# Altium schematic sheet Compressor.SchDoc
size B
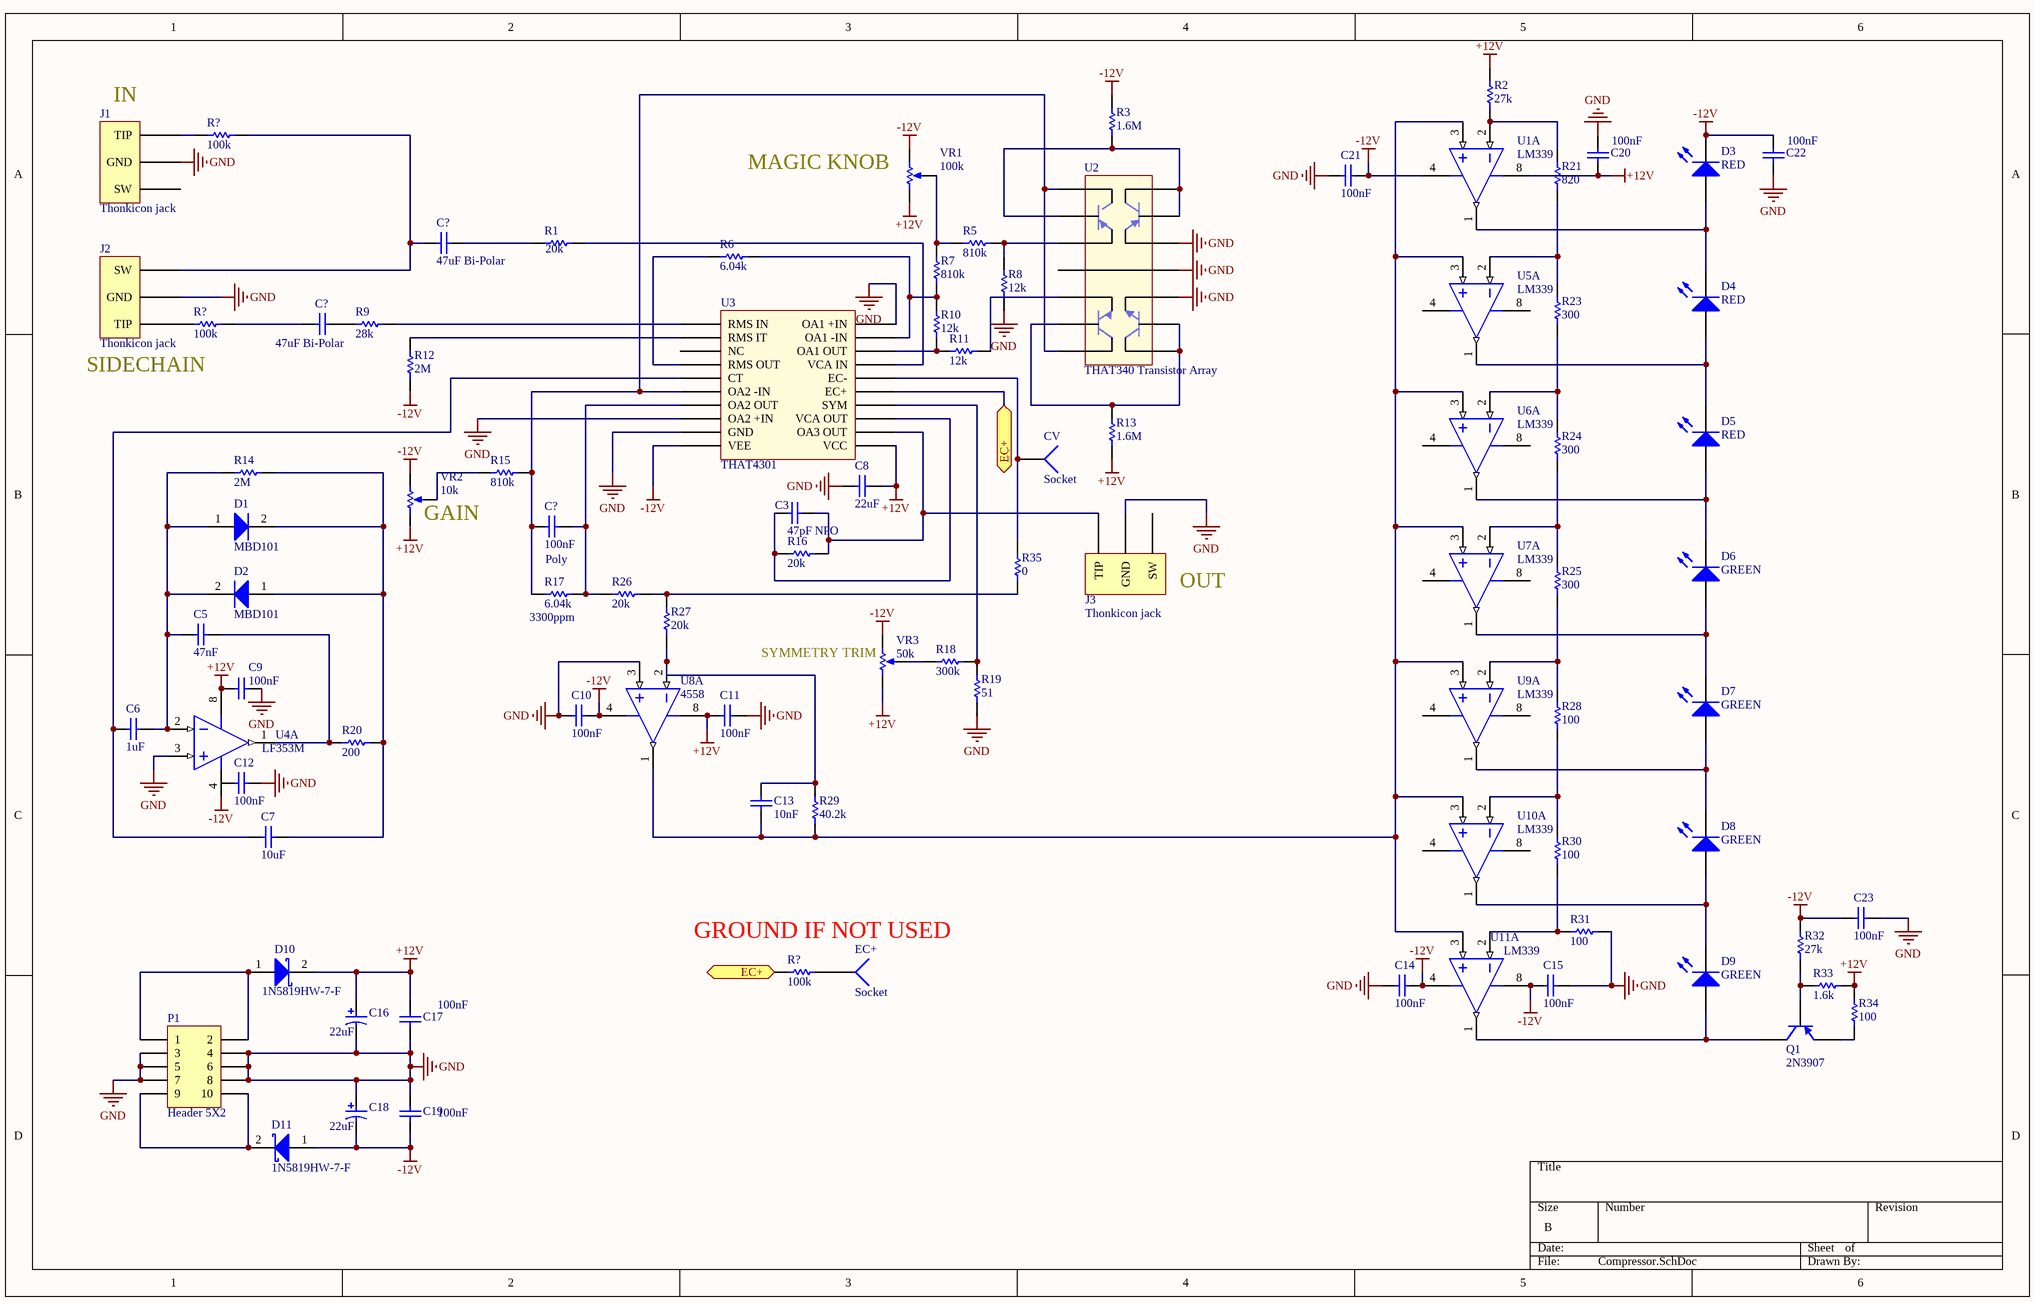
[diagram p0: Compressor.SchDoc]

## Parts
(Parts that share a designator on the sheet are numbered #1, #2 ... from top to bottom, then left to right.)
C3  47pF NPO  [CAPC1206(3216)190_N]
C5  47nF  [CAPC1206(3216)190_N]
C6  1uF  [CAPC1206(3216)190_N]
C7  10uF  [CAPC1206(3216)190_N]
C8  22uF  [CAPC1206(3216)190_N]
C9  100nF  [CAPC0603(1608)100_M]
C10  100nF  [CAPC0603(1608)100_M]
C11  100nF  [CAPC0603(1608)100_M]
C12  100nF  [CAPC0603(1608)100_M]
C13  10nF  [CAPC1206(3216)190_N]
C14  100nF  [CAPC0603(1608)100_M]
C15  100nF  [CAPC0603(1608)100_M]
C16  22uF  [NIC-CAPA2-4X5.8_V]
C17  100nF  [CAPC0603(1608)100_M]
C18  22uF  [NIC-CAPA2-4X5.8_V]
C19  100nF  [CAPC0603(1608)100_M]
C20  100nF  [CAPC0603(1608)100_M]
C21  100nF  [CAPC0603(1608)100_M]
C22  100nF  [CAPC0603(1608)100_M]
C23  100nF  [CAPC0603(1608)100_M]
C?#1  47uF Bi-Polar  [Nichicon Bi-Polar 6.3mm]
C?#2  47uF Bi-Polar  [Nichicon Bi-Polar 6.3mm]
C?#3  100nF  Type: Poly  [WIMA Poly Cap]
CV  Socket  [PIN1]
D1  MBD101  [ONSC-TO-92-2-182-06]
D2  MBD101  [ONSC-TO-92-2-182-06]
D3  RED  [LED-0]
D4  RED  [LED-0]
D5  RED  [LED-0]
D6  GREEN  [LED-0]
D7  GREEN  [LED-0]
D8  GREEN  [LED-0]
D9  GREEN  [LED-0]
D10  1N5819HW-7-F  [DIOD-SOD-123-2_V]
D11  1N5819HW-7-F  [DIOD-SOD-123-2_V]
EC+  Socket  [PIN1]
J1  Thonkicon jack  [Thonkiconn Pot PJ301M]
J2  Thonkicon jack  [Thonkiconn Pot PJ301M]
J3  Thonkicon jack  [Thonkiconn Pot PJ301M]
P1  Header 5X2  [HDR2X5]
Q1  2N3907  [TO-92A]
R1  20k  [RESC0603(1608)_M]
R2  27k  [RESC0603(1608)_M]
R3  1.6M  [RESC0603(1608)_M]
R5  810k  [RESC0603(1608)_M]
R6  6.04k  [RESC0603(1608)_M]
R7  810k  [RESC0603(1608)_M]
R8  12k  [RESC0603(1608)_M]
R9  28k  [RESC0603(1608)_M]
R10  12k  [RESC0603(1608)_M]
R11  12k  [RESC0603(1608)_M]
R12  2M  [RESC0603(1608)_M]
R13  1.6M  [RESC0603(1608)_M]
R14  2M  [RESC0603(1608)_M]
R15  810k  [RESC0603(1608)_M]
R16  20k  [RESC0603(1608)_M]
R17  Temp Cpef: 3300ppm  [RESC0603(1608)_M]  (hidden comment: 6.04k)
R18  300k  [RESC0603(1608)_M]
R19  51  [RESC0603(1608)_M]
R20  200  [RESC0603(1608)_M]
R21  820  [RESC0603(1608)_M]
R23  300  [RESC0603(1608)_M]
R24  300  [RESC0603(1608)_M]
R25  300  [RESC0603(1608)_M]
R26  20k  [RESC0603(1608)_M]
R27  20k  [RESC0603(1608)_M]
R28  100  [RESC0603(1608)_M]
R29  40.2k  [RESC0603(1608)_M]
R30  100  [RESC0603(1608)_M]
R31  100  [RESC0603(1608)_M]
R32  27k  [RESC0603(1608)_M]
R33  1.6k  [RESC0603(1608)_M]
R34  100  [RESC0603(1608)_M]
R35  0  [RESC0603(1608)_M]
R?#1  100k  [RESC0603(1608)_M]
R?#2  100k  [RESC0603(1608)_M]
R?#3  100k  [RESC0603(1608)_M]
U1  LM339  [D0008A_M]  (part A of 2)
U2  THAT340 Transistor Array
U3  THAT4301
U4  LF353M  [D0008A_M]  (part A of 2)
U5  LM339  [D0008A_M]  (part A of 2)
U6  LM339  [D0008A_M]  (part A of 2)
U7  LM339  [D0008A_M]  (part A of 2)
U8  4558  [D0008A_M]  (part A of 2)
U9  LM339  [D0008A_M]  (part A of 2)
U10  LM339  [D0008A_M]  (part A of 2)
U11  LM339  [D0008A_M]  (part A of 2)
VR1  100k  [SonGueiPot]
VR2  10k  [SonGueiPot]
VR3  50k  [SonGueiPot]

## Ports
EC+

## Nets
+12V: C8.1 C9.1 C11.1 C16.1 C17.1 C20.1 D10.2(K) R2.1 R13.2 R33.2 R34.2 U1.8(V+) U3.11(VCC) U4.8(V+) U8.8(V+) VR1.3(CW) VR2.3(CW) VR3.3(CW)
-12V: C10.1 C14.1 C15.1 C18.2 C19.2 C21.1 C22.2 C23.2 D3.2(K) D11.1(A) R3.1 R12.1 R32.2 U1.4(V-) U3.10(VEE) U4.4(V-) U8.4(V-) U11.4(V-) U11.8(V+) VR1.1(CCW) VR2.1(CCW) VR3.1(CCW)
GND: C8.2 C9.2 C10.2 C11.2 C12.2 C14.2 C15.2 C16.2 C17.2 C18.1 C19.1 C20.2 C21.2 C22.1 C23.1 J1.1(GND) J2.1(GND) J3.1(GND) P1.3 P1.4 P1.5 P1.6 P1.7 P1.8 R8.1 R19.2 R31.2 U2.3(E) U2.4(E) U2.5(E) U3.8(OA2_+IN) U3.9(GND) U3.20(OA1_+IN) U4.3(INA+) U8.3(INA+)
EC+: R?#3.2 U3.15(EC+) ; port EC+
NetC3_1: C3.1 J3.3(TIP) R16.1 U3.12(OA3_OUT)
NetC3_2: C3.2 R16.2 U3.13(VCA_OUT)
NetC5_1: C5.1 R20.2 U4.1(OUTA)
NetC5_2: C5.2 C6.1 D1.1(A) D2.2(K) R14.2 U4.2(INA-)
NetC6_2: C6.2 C7.2 U3.5(CT)
NetC7_1: C7.1 D1.2(K) D2.1(A) R14.1 R20.1
NetC13_1: C13.1 R27.1 R29.1 U8.2(INA-)
NetC13_2: C13.2 R29.2 U1.3(INA+) U5.3(INA+) U6.3(INA+) U7.3(INA+) U8.1(OUTA) U9.3(INA+) U10.3(INA+) U11.3(INA+)
NetC?#1_1: C?#1.1 R1.2
NetC?#1_2: C?#1.2 J2.2(SW) R?#1.1
NetC?#2_1: C?#2.1 R9.1
NetC?#2_2: C?#2.2 R?#2.1
NetC?#3_1: C?#3.1 R17.1 R26.1 U3.7(OA2_OUT)
NetC?#3_2: C?#3.2 R15.2 R17.2 U2.8(E) U2.14(E) U3.6(OA2_-IN)
NetCV_1: CV.1 R35.1 U3.16(EC-)
NetD3_1: D3.1(A) D4.2(K) U1.1(OUTA)
NetD4_1: D4.1(A) D5.2(K) U5.1(OUTA)
NetD5_1: D5.1(A) D6.2(K) U6.1(OUTA)
NetD6_1: D6.1(A) D7.2(K) U7.1(OUTA)
NetD7_1: D7.1(A) D8.2(K) U9.1(OUTA)
NetD8_1: D8.1(A) D9.2(K) U10.1(OUTA)
NetD9_1: D9.1(A) Q1.3(C) U11.1(OUTA)
NetD10_1: D10.1(A) P1.1 P1.2
NetD11_2: D11.2(K) P1.9 P1.10
NetEC+_1: EC+.1 R?#3.1
NetJ1_3: J1.3(TIP) R?#1.2
NetJ2_3: J2.3(TIP) R?#2.2
NetQ1_1: Q1.1(E) R34.1
NetQ1_2: Q1.2(B) R32.1 R33.1
NetR1_1: R1.1 U3.17(VCA_IN)
NetR2_2: R2.2 R21.1 U1.2(INA-)
NetR3_2: R3.2 U2.6(B) U2.7(C) U2.9(B)
NetR5_1: R5.1 R8.2 U2.10(C)
NetR5_2: R5.2 R7.2 VR1.2(WIPER)
NetR6_1: R6.1 U3.4(RMS_OUT)
NetR6_2: R6.2 R7.1 R10.2 U3.19(OA1_-IN)
NetR9_2: R9.2 U3.1(RMS_IN)
NetR10_1: R10.1 R11.2 U3.18(OA1_OUT)
NetR11_1: R11.1 U2.12(C)
NetR12_2: R12.2 U3.2(RMS_IT)
NetR13_1: R13.1 U2.1(C) U2.2(B) U2.13(B)
NetR15_1: R15.1 VR2.2(WIPER)
NetR18_1: R18.1 R19.1 U3.14(SYM)
NetR18_2: R18.2 VR3.2(WIPER)
NetR21_2: R21.2 R23.1 U5.2(INA-)
NetR23_2: R23.2 R24.1 U6.2(INA-)
NetR24_2: R24.2 R25.1 U7.2(INA-)
NetR25_2: R25.2 R28.1 U9.2(INA-)
NetR26_2: R26.2 R27.2 R35.2
NetR28_2: R28.2 R30.1 U10.2(INA-)
NetR30_2: R30.2 R31.1 U11.2(INA-)

Not connected (* = marked no-connect by the designer): C12 1; J1 2(SW); J3 2(SW); U2 11(E); U3 3(NC); U5 4(V-) 8(V+); U6 4(V-) 8(V+); U7 4(V-) 8(V+); U9 4(V-) 8(V+); U10 4(V-) 8(V+)

## Notes on the sheet
- (near J1) IN
- MAGIC KNOB
- SIDECHAIN
- (near VR2) GAIN
- (near J3) OUT
- (near VR3) SYMMETRY TRIM
- GROUND IF NOT USED

## Library data of the parts
C3 C5-C8 C13 = CMP-1037-05002-1: CAP 47uF 10V ±20% 1206 (3216 Metric) Thickness 1.9mm SMD; Case-Metric: 3216; Case-EIA: 1206; Tolerance: Â±20%; Technology: SMT; Rated Voltage: 10 V; Value: 47uF; Max Thickness: 1.9 mm; Distributor: Mouser
C9-C12 C14 C15 C17 C19-C23 = CMP-1035-00002-1: CAP; Mfr: AVX; Mfr_Pn: MM035C104KCZ2A; Distributor: Mouser
  C9-C12 C14 C15 C20-C23: Distributor: Distributor; Distributor_Pn: Distributor_Pn
  C17 C19: Distributor_Pn: 581-MM035C104KCZ2A
C16 C18 = CMP-0687-00016-1: Aluminum Electrolytic Capacitor, UD Series, Low Impedance, 10 uF, 25 V, + / - 20%, -55 to 105 degC, Chip Type, 4 x 5.8 mm D x L, Pb-Free, Reel; Distributor: Mouser; Distributor: Distributor; Distributor_Pn: Distributor_Pn
C?#1 C?#2 = CMP-1037-05002-1: CAP 47uF 10V ±20% 1206 (3216 Metric) Thickness 1.9mm SMD; Mfr: Nichicon; Mfr_Pn: UEP1E470MED; Case-Metric: 3216; Case-EIA: 1206; Tolerance: Â±20%; Technology: SMT; Rated Voltage: 10 V; Value: 47uF; Max Thickness: 1.9 mm; Distributor: Mouser; Distributor_Pn: 647-UEP1E470MED
C?#3 = CMP-1037-05002-1: CAP 47uF 10V ±20% 1206 (3216 Metric) Thickness 1.9mm SMD; Mfr: WIMA; Mfr_Pn: MKS0C031000C00KSSD; Case-Metric: 3216; Case-EIA: 1206; Tolerance: Â±20%; Technology: SMT; Rated Voltage: 10 V; Value: 100nF; Max Thickness: 1.9 mm; Distributor: Mouser; Distributor_Pn: 505-MKS02.1/63/10
D1 D2 = CMP-1055-00719-1: Schottky Barrier Diode, 2-Pin TO-92, Bulk Box; Manufacturer: On Semiconductor; Configuration: Single; ComponentLink2URL: http://www.onsemi.cn/pub_link/Collateral/MBD101-D.PDF; PackageReference: TO-92-2-182-06; PackageDescription: 2-Pin Transistor Outline, Body 4.825 x 3.685 mm, Pitch 2.54 mm; ComponentLink2Description: Datasheet; Packing: Bulk Box; ComponentLink1URL: http://www.onsemi.com/; ComponentLink3URL: http://www.onsemi.com/pub_link/Collateral/182-06.PDF; PartNumber: MBD101; RoHS: FALSE; ComponentLink3Description: Package Specification; DatasheetVersion: Rev. 3; ComponentLink1Description: Manufacturer URL; PackageVersion: Rev. L, 04/1998; Mounting Technology: Through Hole; Distributor: Mouser
D3-D9 = LED0: Typical INFRARED GaAs LED; Published: 8-Jun-2000; LatestRevisionDate: 08-Jul-2005; LatestRevisionNote: Mech Layer 1 removed.; PackageReference: LED-0; Publisher: Altium Limited; PackageDescription: LED; 2 Leads; Distributor: Mouser
D10 D11 = CMP-0303-00003-1: 1.0 A Surface Mount Schottky Barrier Rectifier, 40 V, -65 to 125 degC, 2-Pin SOD-123 Package, RoHS, Tape and Reel; Mfr: Diodes Inc.; Distributor: Mouser; Distributor_Pn: 621-1N5819HW-F; Mfr_Pn: 1N5819HW-7-F
P1 = Header 5X2: Header, 5-Pin, Dual row; Ditributor_Pn: 855-M20-9980545; LatestRevisionDate: 17-Jul-2002; LatestRevisionNote: Re-released for DXP Platform.; Publisher: Altium Limited
Q1 = 2N3906: PNP General Purpose Amplifier; Published: 8-Jun-2000; LatestRevisionDate: 15-Jan-2003; LatestRevisionNote: PCB Footprint 'BCY-W3/D4.7' replaced; DatasheetVersion: 1997; PackageVersion: Sep-1998; PackageReference: TO-92A; Publisher: Altium Limited; PackageDescription: TO, Flat Index; 3 In-Line, Axial Leads; Body Dia. 4.5mm; Leads 0.51 x 0.48 mm (max); ComponentLink1Description: Manufacturer Link; ComponentLink1URL: http://www.fairchildsemi.com/; ComponentLink2Description: Datasheet; ComponentLink2URL: http://www.fairchildsemi.com/ds/2N%2F2N3906.pdf; Distributor: Mouser
R1-R3 R5 R7-R21 R23-R35 = CMP-1012-00002-1: Res; Mfr: Susumu; Mfr_Pn: RR0816P-104-D; Case-EIA: 0603; Tolerance: 5 %; Distributor: Mouser; Distributor: Distributor; Distributor_Pn: Distributor_Pn
  R1 R16 R26 R27: Value: 20k
  R2 R32: Value: 27k
  R3 R13: Value: 1.6M
  R5 R7 R15: Value: 810k
  R8 R10 R11: Value: 12k
  R9: Value: 28k
  R12 R14: Value: 2M
  R17: Value: 6.04k
  R18: Value: 300k
  R19: Value: 51
  R20: Value: 200
  R21: Value: 820
  R23-R25: Value: 300
  R28 R30 R31 R34: Value: 100
  R29: Value: 40.2k
  R33: Value: 1.6k
  R35: Value: 0
R6 = CMP-1012-00002-1: Res; Mfr: Susumu; Mfr_Pn: RR0816P-104-D; Case-EIA: 0603; Tolerance: 5 %; temp coef: 3300 ppm; Value: 6.04k; Distributor: Mouser; Distributor: Distributor; Distributor_Pn: Distributor_Pn
R?#1-R?#3 = CMP-1012-00002-1: Thin Film Resistor; Mfr: Yageo; Mfr_Pn: RT0603FRE07100KL; Case-EIA: 0603; Tolerance: 1 %; Value: 100k; Distributor: Mouser; Distributor_Pn: 603-RT0603FRE07100KL; Distributor: Distributor; Distributor_Pn: Distributor_Pn
U1 U4-U11 = CMP-0055-00855-3: Wide Bandwidth Dual JFET Input Operational Amplifier, 8-pin Narrow SOIC; Manufacturer: Texas Instruments; CompType: Amplifiers; PackageTopMarking: NSZXTT*LF353*M; PowerWise: N; Package Reference: D0008A; Code_JEDEC: MS-012-AA; PackageDescription: SOIC Narrow, 4.9 x 3.9 x 1.45mm, 8 Lead, 1.27mm Pitch; ComponentLink1Description: Datasheet URL; RoHS: N; ComponentLink1URL: http://www.ti.com/general/docs/lit/getliterature.tsp?genericPartNumber=LF353-N&fileType=pdf; PinCount: 8; Code_IPC: SOIC127P600-8; Distributor: Mouser
U2 = THAT340: Distributor: Mouser
VR1-VR3 = CMP-0972-00009-1: Trimming Potentiometer, 5K Ohm +/- 10%, -55 to 125 degC, 3-Pin 19.05 x 4.83 x 6.6 mm THD, Transparent Housing, RoHS; Manufacturer: Bourns; PartNumber: 3006P-7-502ZLF; Resistance (kOhm): 5; Resistance Tolerance: +/- 10%; Rotational Life: 200 Cycles; Number of Turns: 15; PackageDescription: 3-Pin THD, Body 19.05 x 4.83 mm, Height 6.6 mm; ComponentLink3Description: Package Specification; ComponentLink1URL: http://www.bourns.com/; PackageReference: 3006P-3; RoHS: TRUE; PackageVersion: Apr-14; Mounting Technology: Through Hole; ComponentLink3URL: http://www.bourns.com/data/global/pdfs/3006.pdf; ComponentLink1Description: Manufacturer URL; Temperature Range: -55 to 125 degC; DatasheetVersion: Apr-14; ComponentLink2Description: Datasheet; ComponentLink2URL: http://www.bourns.com/data/global/pdfs/3006.pdf; Distributor: Mouser
CV EC+ = Socket: LatestRevisionDate: 17-Jul-2002; LatestRevisionNote: Re-released for DXP Platform.; Publisher: Altium Limited; Distributor: Mouser
J1-J3 = Thonkicon jack: Distributor: Mouser
U3 = THAT4301: Distributor: Mouser